# EAGLE design NodeRGBDiode (EAGLE 4.16)
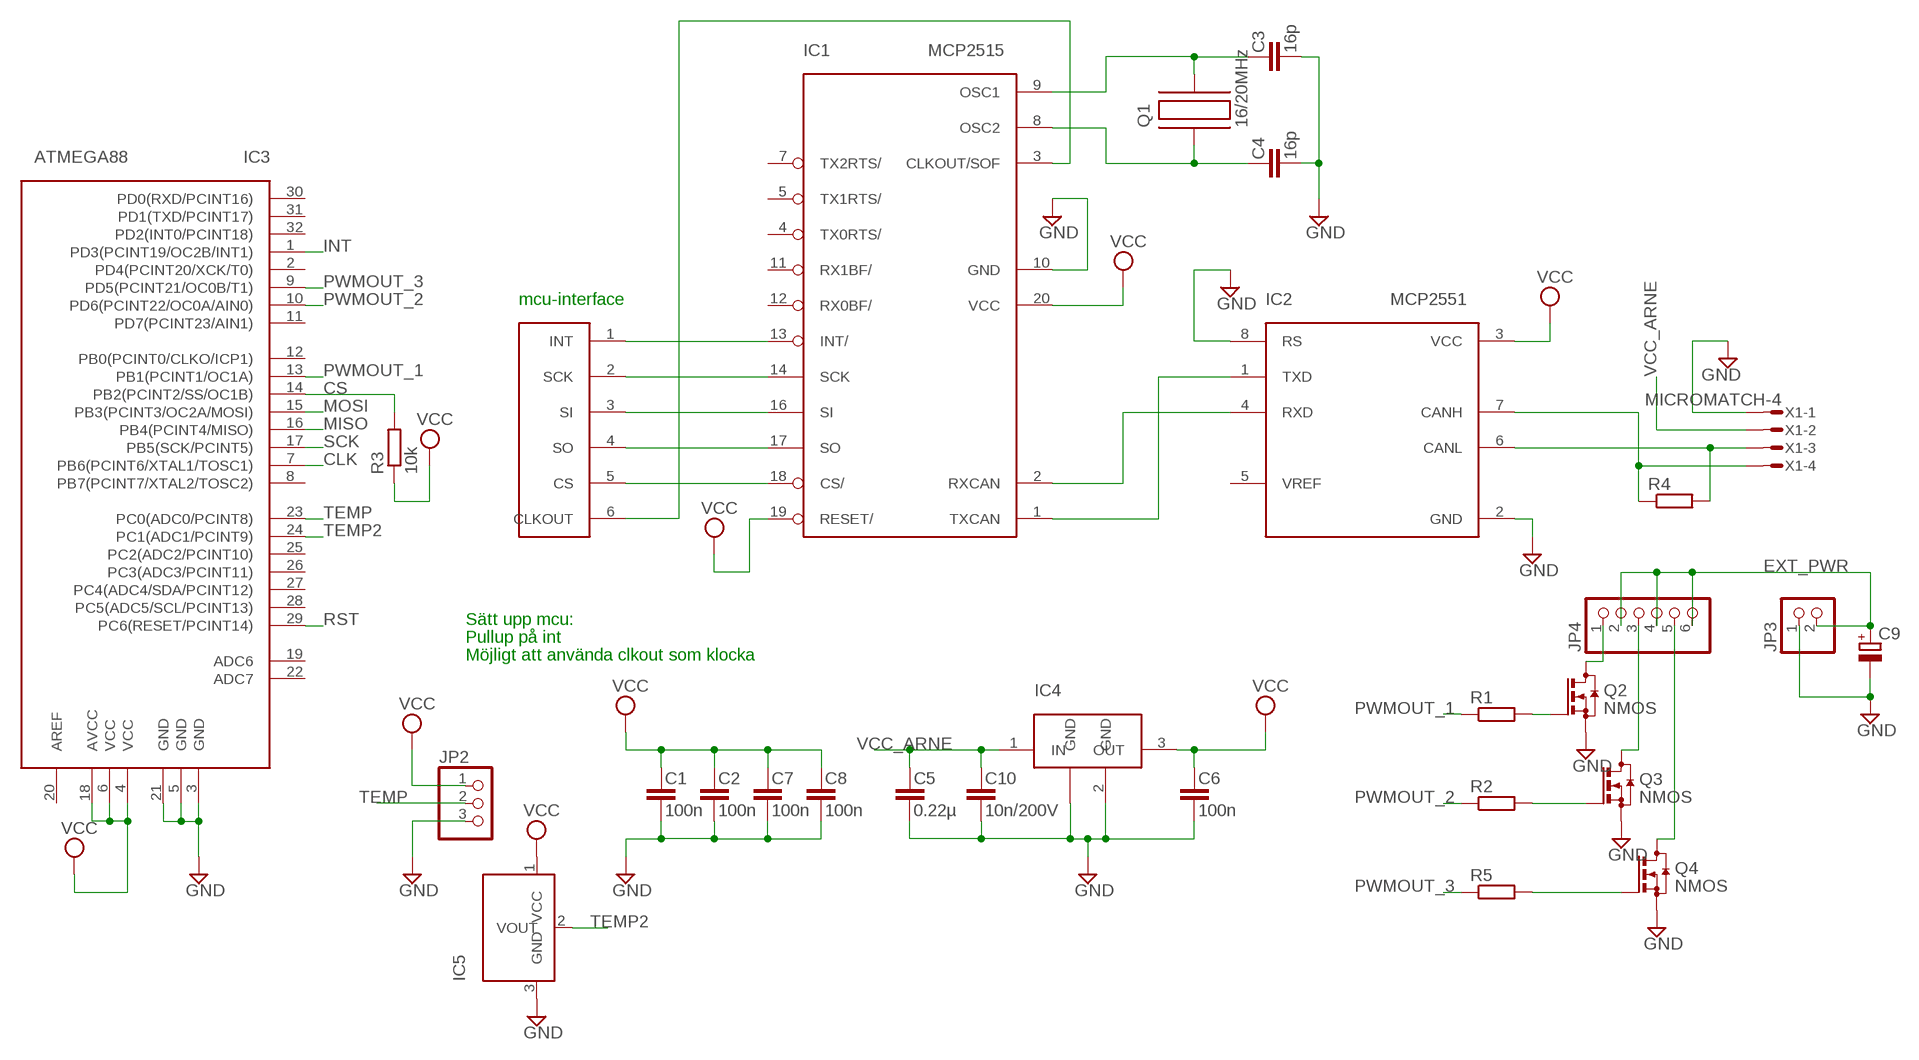
[diagram p0: schematic, sheet 1]

## Parts
C1  100n  C-EU  [C0603]
C2  100n  C-EU  [C0603]
C3  16p  C-EU  [C0603]
C4  16p  C-EU  [C0603]
C5  0.22µ  C-EU  [C0603]
C6  100n  C-EU  [C0603]
C7  100n  C-EU  [C0603]
C8  100n  C-EU  [C0603]
C9  CPOL-EU  [153CLV-0807]
C10  10n/200V  C-EU  [C0603]
IC1  MCP2515  [TSSOP]
IC2  MCP2551  [SOIC]
IC3  ATMEGA88  [TQFP32]
IC4  LM340MP-5.0  [SOT223]
IC5  TC1047A  [SOT23]
JP2  PINHD-1X3  [1X03]
JP3  PINHD-1X2  [1X02]
JP4  PINHD-2X03  [2X03]
Q1  16/20MHz  C-MAC-LFA147E  [SMD]
Q2  NMOS  [SOT23]
Q3  NMOS  [SOT23]
Q4  NMOS  [SOT23]
R1  R-EUR0603  [R0603]
R2  R-EUR0603  [R0603]
R3  10k  R-EUR0603  [R0603]
R4  R-EUR0603  [R0603]
R5  R-EUR0603  [R0603]
U$1  CAN-INTERFACE  [VIA-LIST]
X1  MICROMATCH-4  [MICROMATCH-4]

## Nets
CANH: IC2.7(CANH) R4.1 X1.4
CANL: IC2.6(CANL) R4.2 X1.3
CLK: IC1.3(CLKOUT/SOF) IC3.7(PB6(PCINT6/XTAL1/TOSC1)) U$1.6(CLKOUT)
CS: IC1.18(CS/) IC3.14(PB2(PCINT2/SS/OC1B)) R3.2 U$1.5(CS)
EXT_PWR: C9.+ JP3.2 JP4.2 JP4.4 JP4.6
GND: C1.2 C2.2 C3.2 C4.2 C5.2 C6.2 C7.2 C8.2 C9.- C10.2 IC1.10(GND) IC2.2(GND) IC2.8(RS) IC3.3(GND) IC3.5(GND) IC3.21(GND) IC4.2(GND) IC4.4(GND) IC5.3(GND) JP2.3 JP3.1 Q2.2(S) Q3.2(S) Q4.2(S) X1.1
INT: IC1.13(INT/) IC3.1(PD3(PCINT19/OC2B/INT1)) U$1.1(INT)
MISO: IC1.17(SO) IC3.16(PB4(PCINT4/MISO)) U$1.4(SO)
MOSI: IC1.16(SI) IC3.15(PB3(PCINT3/OC2A/MOSI)) U$1.3(SI)
N$1: IC1.2(RXCAN) IC2.4(RXD)
N$2: IC1.1(TXCAN) IC2.1(TXD)
N$3: Q2.1(G) R1.2
N$4: Q3.1(G) R2.2
N$5: Q4.1(G) R5.2
N$6: JP4.1 Q2.3(D)
N$7: JP4.3 Q3.3(D)
N$8: JP4.5 Q4.3(D)
N$12: C3.1 IC1.9(OSC1) Q1.P$2
N$13: C4.1 IC1.8(OSC2) Q1.P$1
PWMOUT_1: IC3.13(PB1(PCINT1/OC1A)) R1.1
PWMOUT_2: IC3.10(PD6(PCINT22/OC0A/AIN0)) R2.1
PWMOUT_3: IC3.9(PD5(PCINT21/OC0B/T1)) R5.1
RST: IC3.29(PC6(RESET/PCINT14))
SCK: IC1.14(SCK) IC3.17(PB5(SCK/PCINT5)) U$1.2(SCK)
TEMP: IC3.23(PC0(ADC0/PCINT8)) JP2.2
TEMP2: IC3.24(PC1(ADC1/PCINT9)) IC5.2(VOUT)
VCC: C1.1 C2.1 C6.1 C7.1 C8.1 IC1.19(RESET/) IC1.20(VCC) IC2.3(VCC) IC3.4(VCC) IC3.6(VCC) IC3.18(AVCC) IC4.3(OUT) IC5.1(VCC) JP2.1 R3.1
VCC_ARNE: C5.1 C10.1 IC4.1(IN) X1.2
Unconnected: IC1.4(TX0RTS/) IC1.5(TX1RTS/) IC1.7(TX2RTS/) IC1.11(RX1BF/) IC1.12(RX0BF/) IC2.5(VREF) IC3.2(PD4(PCINT20/XCK/T0)) IC3.8(PB7(PCINT7/XTAL2/TOSC2)) IC3.11(PD7(PCINT23/AIN1)) IC3.12(PB0(PCINT0/CLKO/ICP1)) IC3.19(ADC6) IC3.20(AREF) IC3.22(ADC7) IC3.25(PC2(ADC2/PCINT10)) IC3.26(PC3(ADC3/PCINT11)) IC3.27(PC4(ADC4/SDA/PCINT12)) IC3.28(PC5(ADC5/SCL/PCINT13)) IC3.30(PD0(RXD/PCINT16)) IC3.31(PD1(TXD/PCINT17)) IC3.32(PD2(INT0/PCINT18))

## Notes on the sheet
- mcu-interface
- Sätt upp mcu:
- Pullup på int
- Möjligt att använda clkout som klocka

## Library data of the parts
C1-C8 C10 = rcl:C-EU
C9 = rcl:CPOL-EU
IC1 = mcp2515:MCP2515
IC2 = mcp2551:MCP2551
IC3 = atmega88:ATMEGA88
IC4 = lm340mp:LM340MP-5.0
IC5 = tc1047a:TC1047A
JP2 = pinhead-mm:PINHD-1X3
JP3 = pinhead-mm:PINHD-1X2: PIN HEADER
JP4 = pinhead-mm:PINHD-2X03
Q1 = hc49-4h-smx:C-MAC-LFA147E
Q2-Q4 = transistor:NMOS
R1-R5 = rcl:R-EU
U$1 = can-interface:CAN-INTERFACE
X1 = con-amp-micromatch:MICROMATCH-4: MicroMaTch 4 7-215464-4 / 0-215464-4 Drawing Number C-215464 DDEController.pdf

## Board
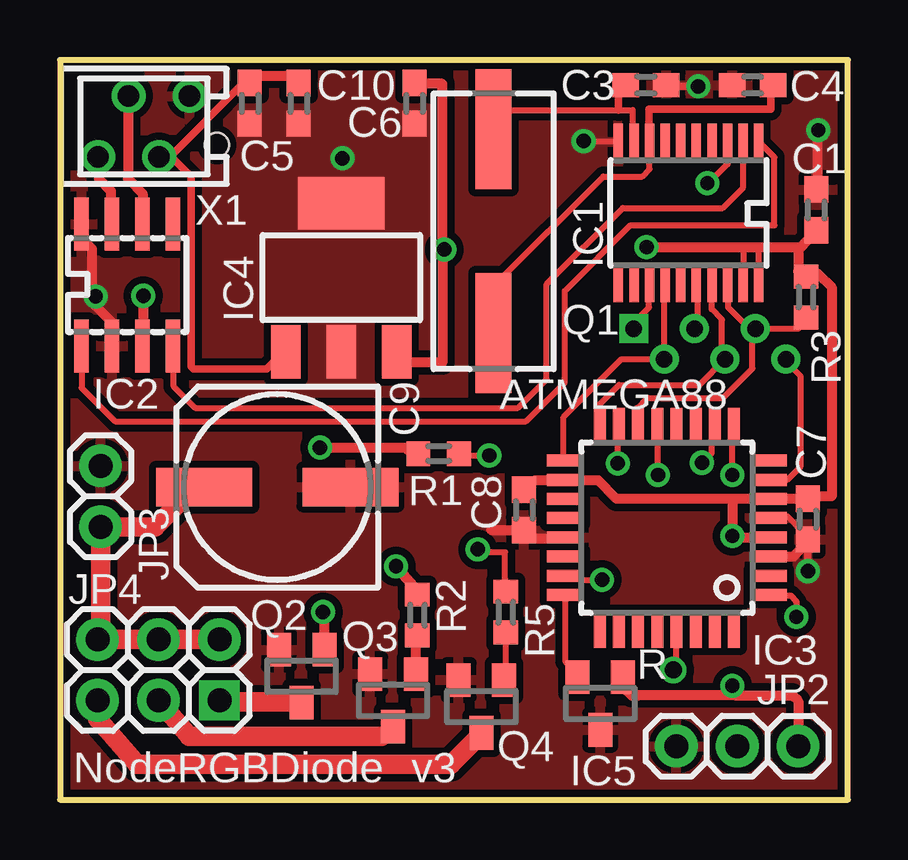
[diagram p1: board, top side]
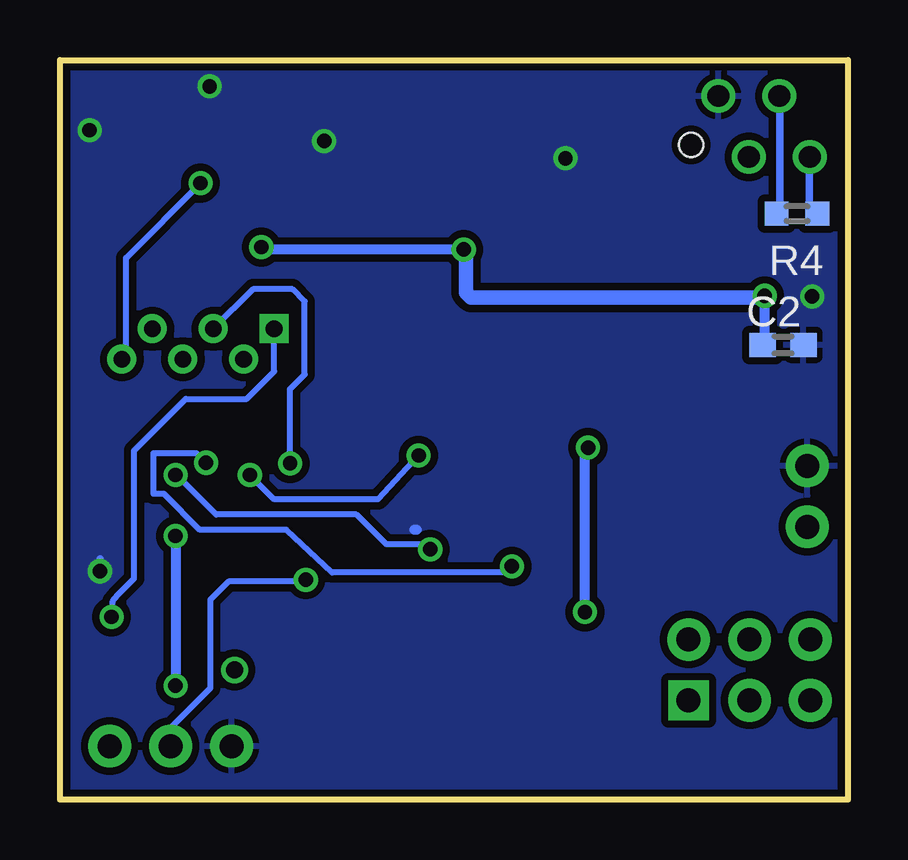
[diagram p2: board, bottom side, seen from below]

Size 32.85 x 30.84 mm. Coordinates in mm from the lower left corner, seen from the top.
Outline: 0,0 32.85,0 32.85,30.84 0,30.84 0,0
Copper layers (1*16): Top 0.035mm / dielectric 1.5mm / Bottom 0.035mm
Design rules "10mils, 0.6drill": minimum track width 10mil, minimum drill 0.6mm, track to track 10mil, track to pad 10mil, pad to pad 10mil, via to via 10mil, smd to smd 10mil, copper to edge 10mil, drill to drill 10mil, minimum pad ring 10mil, minimum via ring 8mil, stop-mask expansion 0mil, vias tented up to drill 0mil, thermal gap 10mil

### Footprints (pad centres in the part's own frame; a part is rotated, then mirrored left to right if it is on the bottom)
C0603 = smd 1.1 x 1: 1 -0.85,0; 2 0.85,0
153CLV-0807 = smd 4 x 1.6: + 3.05,0; - -3.05,0
TSSOP = smd 0.396 x 1.5: 1 -2.925,-2.975; 2 -2.275,-2.975; 3 -1.625,-2.975; 4 -0.975,-2.975; 5 -0.325,-2.975; 6 0.325,-2.975; 7 0.975,-2.975; 8 1.625,-2.975; 9 2.275,-2.975; 10 2.925,-2.975; 11 2.925,2.975; 12 2.275,2.975; 13 1.625,2.975; 14 0.975,2.975; 15 0.325,2.975; 16 -0.325,2.975; 17 -0.975,2.975; 18 -1.625,2.975; 19 -2.275,2.975; 20 -2.925,2.975
SOIC = smd 0.6 x 2.2: 1 -1.905,-2.54; 2 -0.635,-2.54; 3 0.635,-2.54; 4 1.905,-2.54; 5 1.905,2.54; 6 0.635,2.54; 7 -0.635,2.54; 8 -1.905,2.54
TQFP32 = smd 1.5 x 0.5: 1 -4.25,2.65; 2 -4.25,1.85; 3 -4.25,1.05; 4 -4.25,0.25; 5 -4.25,-0.55; 6 -4.25,-1.35; 7 -4.25,-2.15; 8 -4.25,-2.95; 17 4.25,-2.95; 18 4.25,-2.15; 19 4.25,-1.35; 20 4.25,-0.55; 21 4.25,0.25; 22 4.25,1.05; 23 4.25,1.85; 24 4.25,2.65 | smd 0.5 x 1.5: 9 -2.8,-4.4; 10 -2,-4.4; 11 -1.2,-4.4; 12 -0.4,-4.4; 13 0.4,-4.4; 14 1.2,-4.4; 15 2,-4.4; 16 2.8,-4.4; 25 2.8,4.1; 26 2,4.1; 27 1.2,4.1; 28 0.4,4.1; 29 -0.4,4.1; 30 -1.2,4.1; 31 -2,4.1; 32 -2.8,4.1
SOT223 = smd 1.219 x 2.235: 1 -2.311,-3.099; 2 0,-3.099; 3 2.311,-3.099 | smd 3.6 x 2.2: 4 0,3.099
SOT23 = smd 1 x 1.4: 1 -0.95,-1.1; 2 0.95,-1.1; 3 0,1.1
1X03 = drill 1 pad 1.778 round: 1 -2.54,0; 2 0,0; 3 2.54,0
1X02 = drill 1 pad 1.778 round: 1 -1.27,0; 2 1.27,0
2X03 = drill 1 pad 1.676 square: 1 -2.54,1.27 | drill 1 pad 1.778 round: 2 -2.54,-1.27; 3 0,1.27; 4 0,-1.27; 5 2.54,1.27; 6 2.54,-1.27
SMD = smd 5 x 1.5: P$1 4.25,0; P$2 -4.25,0
R0603 = smd 0.991 x 1.016: 1 -0.85,0; 2 0.85,0
VIA-LIST = drill 0.7 square: 1 0,2.54 | drill 0.7 round: 2 -1.27,1.27; 3 0,0; 4 -1.27,-1.27; 5 0,-2.54; 6 -1.27,-3.81
MICROMATCH-4 = drill 0.9 round: 1 1.905,1.27; 2 0.635,-1.27; 3 -0.635,1.27; 4 -1.905,-1.27 | hole 1: 3.048,-0.762

### Placement (x,y rotation side)
C1  31.54,24.59 90 top
C2  2.7,18.96 0 bottom
C3  24.43,29.79 0 top
C4  28.87,29.79 180 top
C5  7.92,29.03 270 top
C6  14.77,29.03 270 top
C7  31.17,11.7 270 top
C8  19.34,12.08 270 top
C9  9.06,13.03 180 top
C10  9.95,29.03 270 top
IC1  26.21,24.46 180 top
IC2  2.8,21.46 0 top
IC3  25.3,11.19 180 top
IC4  11.73,21.77 0 top
IC5  22.52,4.01 180 top
JP2  28.24,2.24 180 top
JP3  1.69,12.65 270 top
JP4  4.11,5.41 180 top
Q1  18.08,23.7 270 top
Q2  10.07,5.16 180 top
Q3  13.88,4.14 180 top
Q4  17.57,3.89 180 top
R1  15.79,14.43 180 top
R2  14.9,7.7 270 top
R3  31.11,20.96 270 top
R4  2.12,24.44 180 bottom
R5  18.58,7.82 270 top
U$1  26.46,19.63 90 top
X1  3.5,28.07 0 top

### Tracks (layer width: path | path; a pad name or v marks a point on that pad's centre or on a via)
CANH
  Top 0.305: 2.12,24.04 IC2.7 | X1.4 1.62,26.8
  Top 0.406: 2.12,24.04 2.12,25.38 1.62,25.88 1.62,26.8
  Bottom 0.305: X1.4 1.62,26.8 1.62,24.78 R4.1
CANL
  Top 0.305: IC2.6 | X1.3 2.84,29.34
  Top 0.406: IC2.6 3.45,25.27 2.84,25.88 2.84,29.34
  Bottom 0.305: X1.3 2.84,29.34 2.84,24.57 R4.2
CLK  (via drill 0.6)
  Top 0.254: IC1.3 27.83,27.33 27.83,26.49 27.02,25.68 v26.99,25.71 | IC3.7 30.32,13.34 30.88,13.89 30.88,17.65 30.22,18.31 30.17,18.36
  Top 0.406: 30.17,18.26 30.22,18.31 U$1.6
  Bottom 0.254: v26.99,25.71 30.09,22.58 30.09,18.52 U$1.6
CS
  Top 0.254: IC1.18 27.83,21.61 27.86,21.61 27.86,20.52 28.87,19.51 | IC3.14 24.07,15.72 | 24.07,15.72 24.07,15.74 | 28.87,19.51 28.87,17.98 27.63,16.74 24.48,16.74 24.07,16.33 24.07,15.93 24.17,15.22 24.07,15.72 | 28.87,19.51 U$1.5 30.78,19.63 31.03,19.89 31.03,20.09 30.97,20.09 R3.2
EXT_PWR
  Top 0.813: JP4.2 JP4.4 JP4.6 1.69,6.81 JP3.2 3.98,11.38 5.75,13.16 | 5.75,13.16 5.76,13.16 | 5.75,13.16 C9.+
GND  (via drill 0.6)
  Top 0.254: v21.84,27.46 23.28,27.46 IC1.10 | C1.2 31.59,25.76 | 1.34,20.73 v1.49,20.98 | 20.56,10.9 IC3.21 21.28,10.92 | C8.2 19.8,10.9 | C7.2 31.11,11.18 30.93,11.18 30.32,11.81 29.76,11.76 29.74,11.74 IC3.5 | v31.61,27.91 31.44,27.86 31.59,27.71
  Top 0.305: IC2.2 2.2,19.25 | C3.2 25.45,29.74 v26.61,29.74 | 30.93,11.18 31.16,11.18 31.18,11.15 31.18,10.64 v31.18,9.53
  Top 0.406: 2.2,19.25 2.2,19.86 1.34,20.73 1.34,22.96 0.83,23.47 IC2.8 | 19.8,10.9 20.56,10.9 | 31.59,25.76 31.59,27.71 | 31.18,10.64 31.08,10.64 30.58,10.14 IC3.3 | C8.2 18,11.23 17.97,11.25
  Bottom 0.305: v26.61,29.74 26.56,29.82 | v31.18,9.53 31.18,10.03
  Bottom 0.406: 17.97,11.25 18.08,11.25
  other vias: 11.78,26.74
  pour Bottom (isolate 0.305): 0.12,30.73 32.83,30.73 32.83,0.1 24.38,0.1 0.12,0.1
  pour Top (isolate 0.305, no thermals): 5.83,30.37 15.89,30.37 15.89,16.65 5.83,16.65
  pour Top (isolate 0.305): 0.17,30.68 32.68,30.68 32.68,0.08 0.17,0.08
INT  (via drill 0.6)
  Top 0.254: IC1.13 | IC1.13 | U$1.1 23.92,19.89 24.55,20.52 24.55,21.46 IC1.13 | IC3.1 29.48,8.54 29.46,8.51 30.01,8.56 30.07,8.51 30.47,8.51 30.52,8.46 30.7,8.26 v30.7,7.62
  Bottom 0.254: v30.7,7.62 30.65,8.28 30.45,8.53 29.76,9.22 29.76,14.55 27.6,16.71 25.06,16.71 23.92,17.86 U$1.1
MISO
  Top 0.254: IC1.17 27.18,21.55 27.17,21.54 27.17,20.45 27.6,20.02 27.6,18.62 27.73,18.49 U$1.4 26.66,17.3 23.31,17.3 22.45,16.43 22.45,15.11 22.44,15.1 22.41,15.1 | IC3.16 22.41,15.1 | 22.41,15.1 22.39,15.18
MOSI  (via drill 0.6)
  Top 0.254: IC1.16 26.53,21.61 26.51,21.59 26.51,21.36 26.58,21.29 26.58,19.76 U$1.3 | IC3.15 23.3,15.56 23.26,15.52 v23.26,14.02
  Bottom 0.254: U$1.3 26.51,19.69 | U$1.3 26.41,19.58 | v23.26,14.02 23.26,17.12 22.65,17.73 22.65,20.78 23.16,21.29 24.81,21.29 U$1.3
N$1
  Top 0.254: 4.77,18.87 4.75,18.87 IC2.4 4.71,18.9 4.74,18.87 4.74,17.22 5.63,16.33 19.09,16.33 20.29,17.53 20.29,21.49 23.46,24.66 27.63,24.66 28.48,25.52 IC1.2
N$2
  Top 0.254: IC1.1 29.79,26.79 29.79,23.95 23.79,23.95 21.05,21.21 21.05,17.4 19.42,15.77 2.3,15.77 0.91,17.17 IC2.1 | IC2.1 0.91,18.97 | IC2.1
N$3  (via drill 0.6)
  Top 0.406: Q2.1 11.02,7.76 v10.96,7.82 | R1.2 14.65,14.43 14.39,14.68 v10.84,14.68
  Bottom 0.406: v10.96,7.82 10.96,14.55 v10.84,14.68
N$4
  Top 0.406: R2.2 14.9,6.68 14.84,6.61 Q3.1
N$5
  Top 0.254: R5.2 18.58,5.66 Q4.1
N$6
  Top 0.254: 9.59,4.09 Q2.3
  Top 0.813: 9.59,4.09 6.7,4.09 JP4.1
N$7
  Top 0.254: 13.4,2.64 Q3.3
  Top 0.813: 13.4,2.64 5.38,2.64 JP4.3
N$8
  Top 0.305: 17.57,2.74 Q4.3
  Top 0.813: JP4.5 1.57,3.38 3.22,1.47 15.66,1.47 16.3,1.47 17.57,2.74
N$12
  Top 0.254: IC1.9 23.87,27.79 23.87,28.75 23.28,28.75 18.13,28.75 Q1.P$2
  Top 0.305: C3.1 23.28,29.32 23.28,28.75
N$13
  Top 0.254: Q1.P$1 18.14,21.48 22.65,25.98 24.27,25.98 24.58,26.29 24.58,27.2 24.55,27.23 24.55,27.31
  Top 0.305: IC1.8 24.55,27.31 24.55,28.78 29.63,28.78 29.63,29.83 C4.1
PWMOUT_1  (via drill 0.6)
  Top 0.254: v17.9,14.35 16.96,14.35 R1.1 | v24.93,13.54 24.93,14.86 IC3.13
  Bottom 0.254: v17.9,14.35 19.6,12.52 23.92,12.52 v24.93,13.54
PWMOUT_2  (via drill 0.6)
  Top 0.254: v26.76,14.05 27.17,14.45 27.17,14.86 IC3.10
  Top 0.406: R2.1 14.9,8.71 v14.01,9.73
  Bottom 0.254: v26.76,14.05 27.17,14.45 28.95,14.45 28.95,12.75 28.51,12.75 27.02,11.25 23.41,11.25 21.5,9.47 14.27,9.47 v14.01,9.73
PWMOUT_3  (via drill 0.6)
  Top 0.254: v28.03,13.54 28.03,14.86 IC3.9 | v17.42,10.44 17.44,10.36 17.49,10.31 18.56,10.31 18.56,9.22 18.51,8.71 R5.1
  Bottom 0.254: v17.42,10.44 17.42,10.64 19.24,10.64 20.49,11.89 26.33,11.89 26.46,12.01 | v28.03,13.54 27.98,13.54 26.46,12.01 | 26.46,12.01 26.41,11.96
RST  (via drill 0.7)
  Top 0.254: v25.57,5.41 25.7,5.54 25.7,7.06 25.7,7.07 IC3.29
SCK
  Top 0.254: IC1.14 25.23,21.58 25.19,21.54 IC1.14 25.19,21.49 U$1.2 23.41,18.36 21,15.95 21,14.07 IC3.17
TEMP  (via drill 0.6)
  Top 0.254: v22.6,9.17 21.78,9.17 IC3.23
  Bottom 0.254: JP2.2 28.24,3 26.58,4.65 26.58,8.33 25.82,9.09 22.65,9.09 22.6,9.14 v22.6,9.17
TEMP2
  Top 0.254: IC5.2 21.07,5.77 21.07,8.31 IC3.24
VCC  (via drill 0.6)
  Top 0.254: IC1.20 29.12,21.61 29.12,23.04 29.68,23.04 | IC1.19 28.48,21.55 28.49,21.54 28.49,23.04 28.49,23.06 | 30.57,23.09 30.78,23.09 30.9,23.06 | 21.28,13.31 IC3.18 20.31,13.34 20.31,13.31 | 29.05,12.55 IC3.6 29.66,12.57 29.81,12.55 | v28.03,4.75 28.16,4.34
  Top 0.305: 23.54,4.65 IC5.1
  Top 0.406: 15.95,22.94 15.95,18.23 14.08,18.23 14.08,18.92 IC4.3 | IC2.3 3.42,19.3 3.47,19.79 v3.47,21.01 | 15.95,22.94 15.95,29.85 14.83,29.85 14.77,29.79 C6.1 | v16.02,22.94 15.95,22.94 | v24.45,23.04 28.49,23.04 29.68,23.04 | 29.68,23.04 | 20.56,13.31 20.31,13.31 19.8,13.31 C8.1 | 29.81,12.55 30.7,12.55 C7.1 31.41,12.65 32.17,12.65 32.17,21.36 31.61,21.92 30.88,21.92 | 29.68,23.04 30.78,23.04 | 30.78,23.04 30.9,23.04 30.9,23.06 C1.1 | 30.88,21.92 30.88,21.83 R3.1 | 30.88,21.92 30.78,22.02 30.78,23.04 | 21.28,13.31 22.45,13.31 23.21,12.55 27.98,12.55 | 29.05,12.55 27.98,12.55 | 23.54,4.65 23.84,4.34 24.1,4.34 28.16,4.34 30.52,4.34 30.78,4.12 JP2.1 | 27.98,12.55 27.98,12.52 28.03,12.47 v28.03,11 28.11,11 28.17,10.94 IC3.4
  Bottom 0.254: C2.1 3.47,19.46
  Bottom 0.406: 3.47,19.46 3.47,20.93 v3.47,21.01 | v24.45,23.04 24.4,23.04 24.3,22.94 v16.02,22.94 | v28.03,11 v28.03,4.75
  Bottom 0.61: 3.47,20.93 15.71,20.93 15.92,21.13 15.92,22.94 v16.02,22.94
VCC_ARNE
  Top 0.254: 7.88,29.85 C5.1
  Top 0.305: IC4.1 9.31,18.67 8.61,17.96 5.58,17.96 5.48,18.06 5.48,25.98 4.67,26.8 4.26,26.8 | 7.88,29.85 7.61,29.85 4.56,26.8 4.26,26.8 | 4.26,26.8 X1.2
  Top 0.406: C10.1 9.95,30.18 7.92,30.18 C5.1

### Text on the board
tPlace: R | NodeRGBDiode | v3